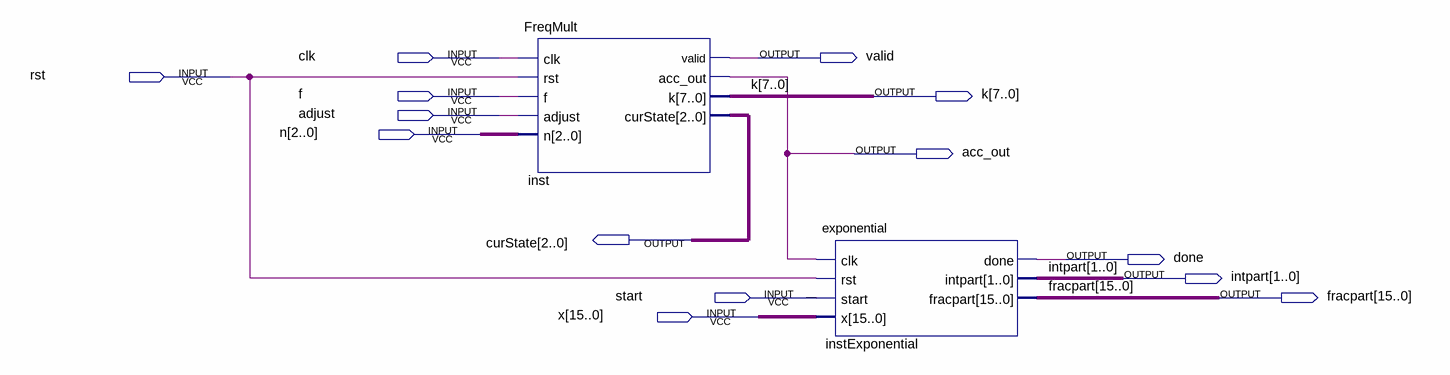
[diagram p0: schematic sheet]
// Quartus schematic integ.bdf as structural Verilog: 2 symbols, 14 pins
module integ (
  input  clk,
  input  rst,
  input  f,
  input  adjust,
  input  [2:0] n,
  input  start,
  input  [15:0] x,
  output valid,
  output [7:0] k,
  output acc_out,
  output [2:0] curState,
  output done,
  output [1:0] intpart,
  output [15:0] fracpart
);

  FreqMult inst (
    .clk(clk), .rst(rst), .f(f), .adjust(adjust), .n(n), .valid(valid), .acc_out(acc_out), .k(k),
    .curState(curState));
  exponential instExponential (
    .clk(acc_out), .rst(rst), .start(start), .x(x), .done(done), .intpart(intpart), .fracpart(fracpart));
endmodule
